# EAGLE schematic Charger (EAGLE 9.6.2)

## Sheet 1 of 2
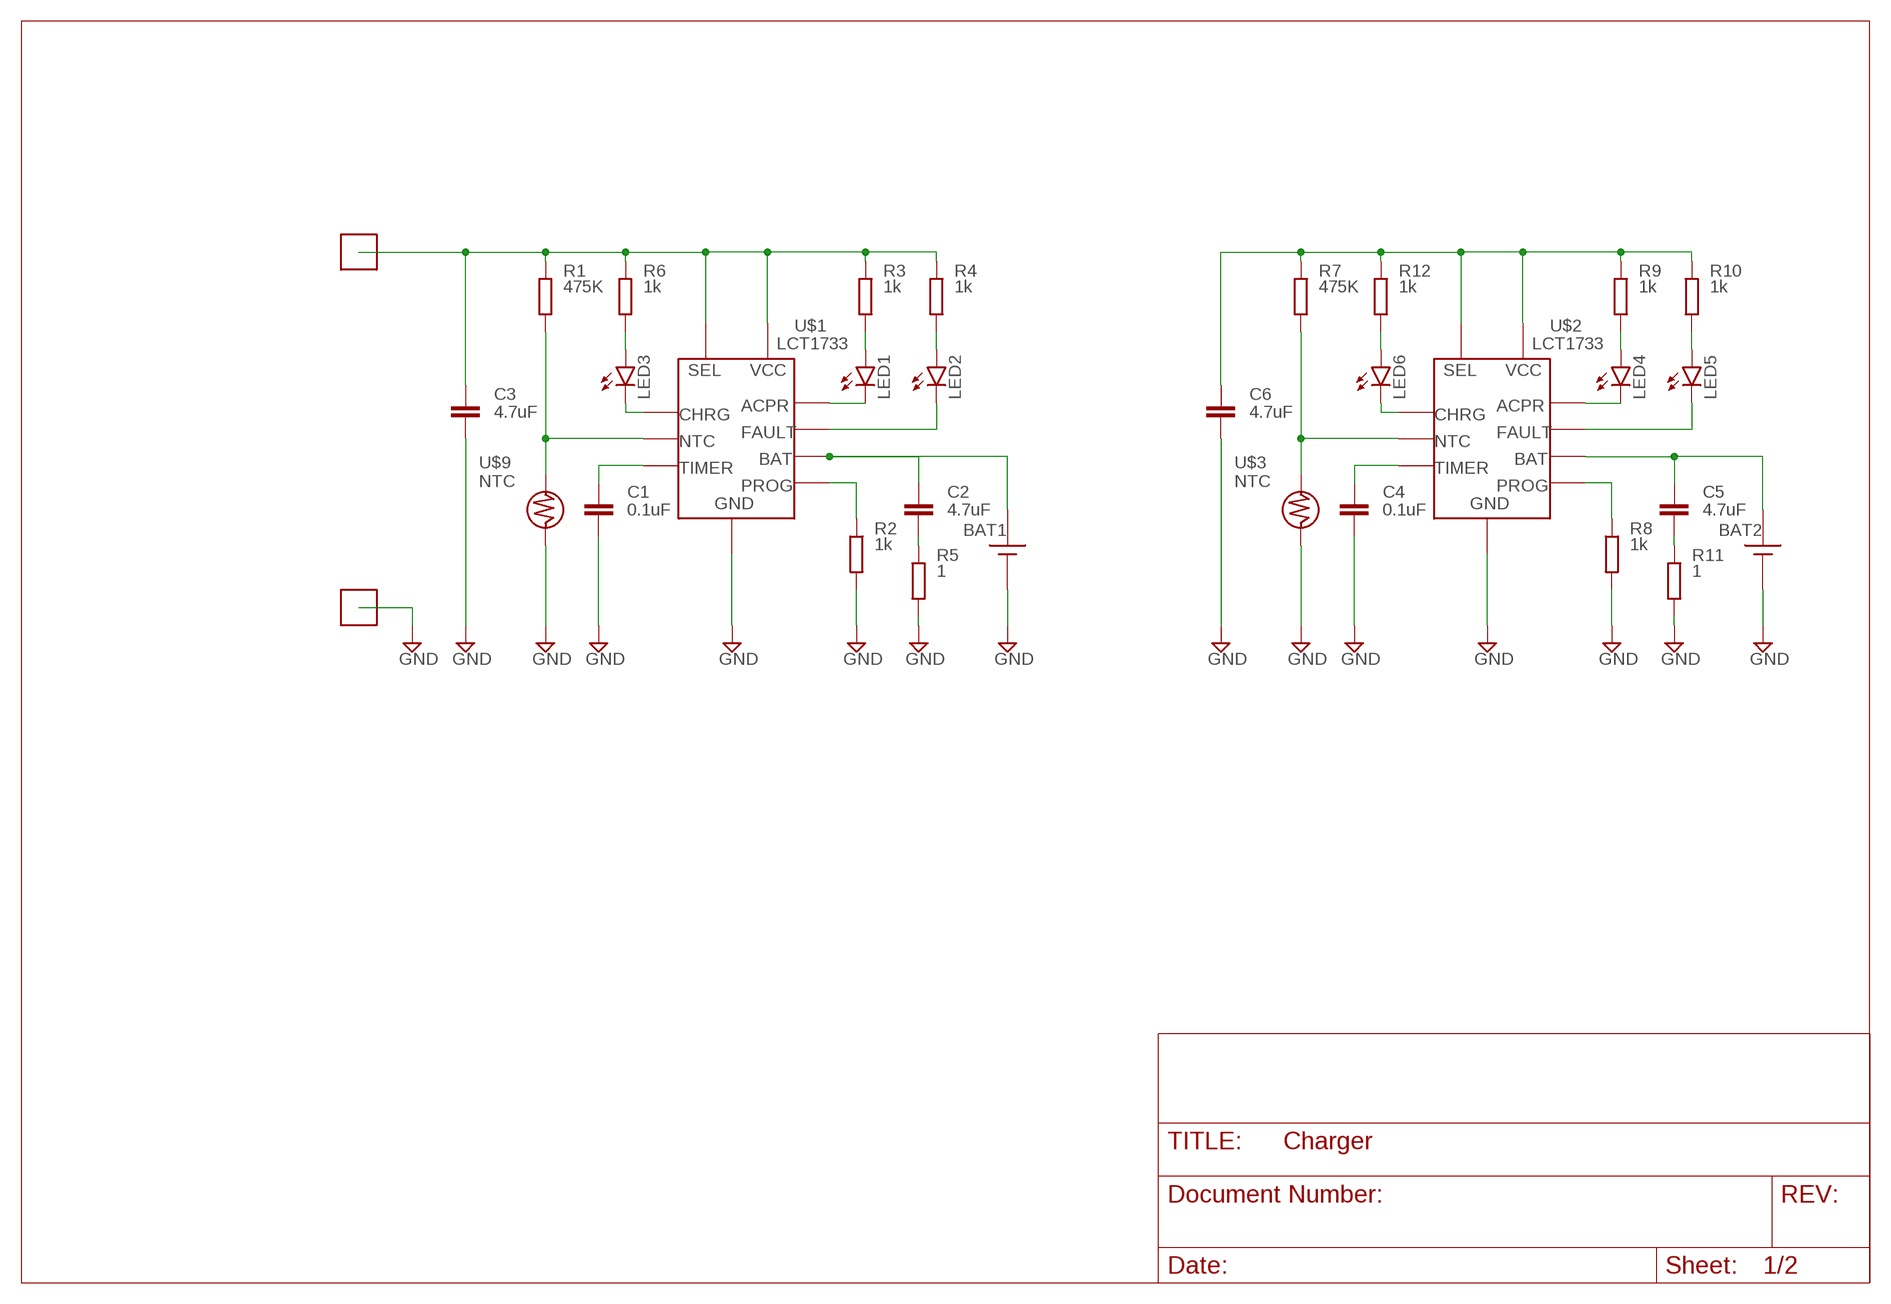
[diagram p0: schematic, sheet 1]

### Parts
BAT1  BATBAT  [BAT2]
BAT2  BAT  [BAT]
C1  0.1uF  C-EUC0603  [C0603]
C2  4.7uF  C-EUC0603  [C0603]
C3  4.7uF  C-EUC0603  [C0603]
C4  0.1uF  C-EUC0603  [C0603]
C5  4.7uF  C-EUC0603  [C0603]
C6  4.7uF  C-EUC0603  [C0603]
LED1  LEDSML0603  [SML0603]
LED2  LEDSML0603  [SML0603]
LED3  LEDSML0603  [SML0603]
LED4  LEDSML0603  [SML0603]
LED5  LEDSML0603  [SML0603]
LED6  LEDSML0603  [SML0603]
R1  475K  R-EU_R0603  [R0603]
R2  1k  R-EU_R0603  [R0603]
R3  1k  R-EU_R0603  [R0603]
R4  1k  R-EU_R0603  [R0603]
R5  1  R-EU_R0603  [R0603]
R6  1k  R-EU_R0603  [R0603]
R7  475K  R-EU_R0603  [R0603]
R8  1k  R-EU_R0603  [R0603]
R9  1k  R-EU_R0603  [R0603]
R10  1k  R-EU_R0603  [R0603]
R11  1  R-EU_R0603  [R0603]
R12  1k  R-EU_R0603  [R0603]
U$1  LCT1733  [MSOP-10_MSE]
U$2  LCT1733  [MSOP-10_MSE]
U$3  NTC  [C0603]
U$4  CONNECTOR  [VCC]
U$5  CONNECTOR  [VCC]
U$9  NTC  [C0603]

### Nets
GND: BAT1.P$2(-) BAT2.P$2(-) C1.2 C3.2 C4.2 C6.2 R2.2 R5.2 R8.2 R11.2 U$1.5(GND) U$1.11(GND) U$2.5(GND) U$2.11(GND) U$3.2 U$5.P$1 U$9.2
N$1: C3.1 R1.1 R3.1 R4.1 R6.1 U$1.2(VCC) U$1.8(SEL) U$4.P$1
N$2: R2.1 U$1.7(PROG)
N$3: LED1.C U$1.10(ACPR)
N$4: LED1.A R3.2
N$5: LED2.A R4.2
N$6: LED2.C U$1.3(FAULT)
N$7: BAT1.P$1(+) C2.1 U$1.9(BAT)
N$8: C2.2 R5.1
N$9: C1.1 U$1.4(TIM)
N$10: LED3.A R6.2
N$11: LED3.C U$1.1(CHRG)
N$12: R1.2 U$1.6(NTC) U$9.1
N$13: C6.1 R7.1 R9.1 R10.1 R12.1 U$2.2(VCC) U$2.8(SEL)
N$14: LED4.C U$2.10(ACPR)
N$15: LED4.A R9.2
N$16: LED5.A R10.2
N$17: LED5.C U$2.3(FAULT)
N$18: BAT2.P$1(+) C5.1 U$2.9(BAT)
N$19: R8.1 U$2.7(PROG)
N$20: C5.2 R11.1
N$21: C4.1 U$2.4(TIM)
N$22: LED6.A R12.2
N$23: LED6.C U$2.1(CHRG)
N$24: R7.2 U$2.6(NTC) U$3.1

## Sheet 2 of 2
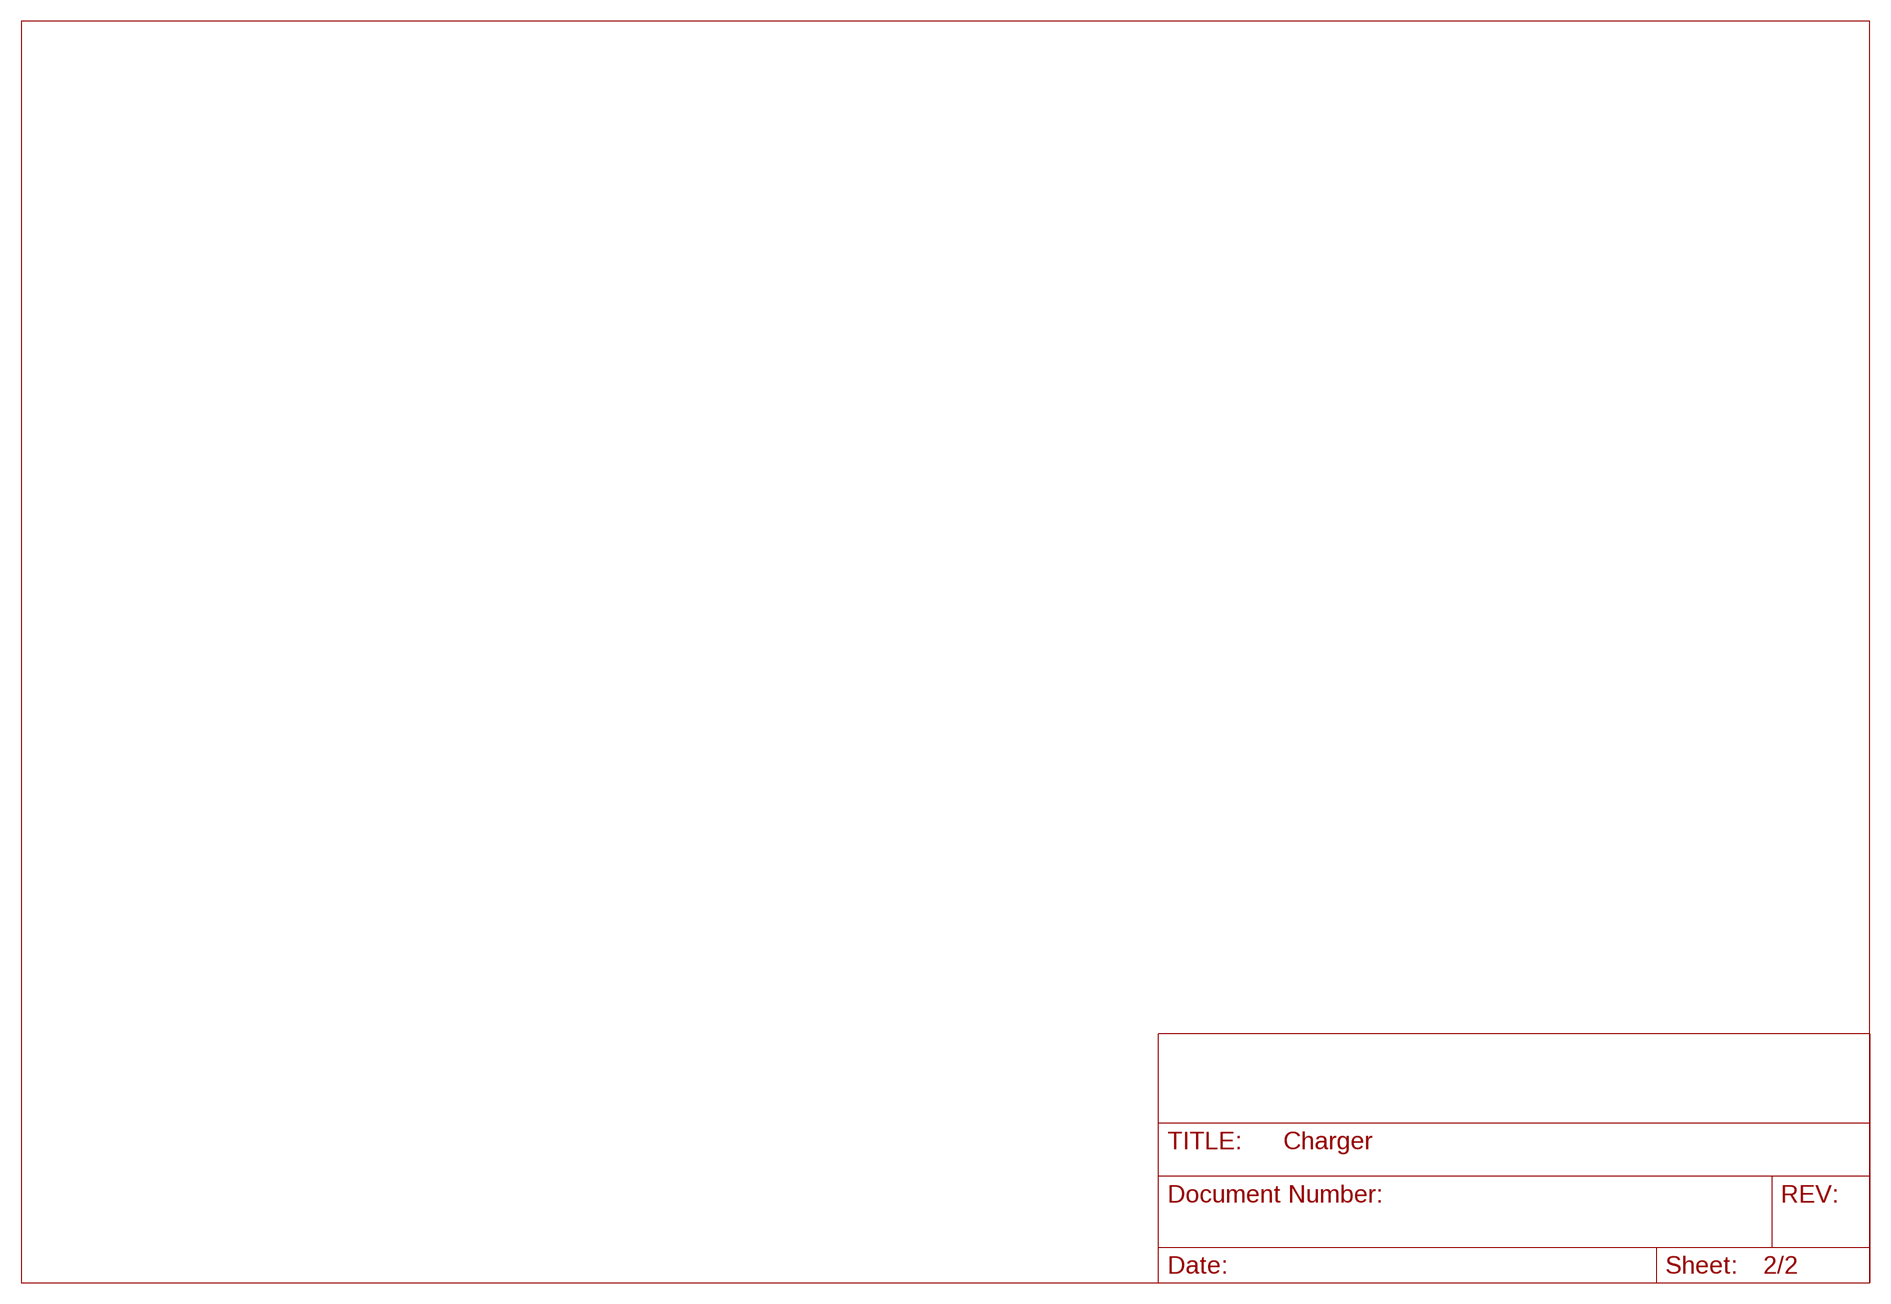
[diagram p1: schematic, sheet 2]

## Library data of the parts
BAT1 BAT2 = SamacSys_Parts:BAT
C1-C6 = rcl:C-EU: CAPACITOR, European symbol; SPICEPREFIX: C
LED1-LED6 = led:LED: LED OSRAM: - CHIPLED LG R971, LG N971, LY N971, LG Q971, LY Q971, LO R971, LY R971 LH N974, LH R974 LS Q976, LO Q976, LY Q976 LO Q996 - Hyper CHIPLED LW Q18S LB Q993, LB Q99A, LB R99A - SideLED LS A670, LO A670, LY A670, LG A670, LP A670 LB A673, LV A673, LT A673, LW A673 LH A674 LY A675 LS A676, LA A676, LO A676, LY A676, LW A676 LS A679, LY A679, LG A679 - Hyper Micro SIDELED® LS Y876, LA Y876, LO Y876, LY Y876 LT Y87S - SmartLED LW L88C, LW L88S LB L89C, LB L89S, LG L890 LS L89K, LO L89K, LY L89K LS L896, LA L896, LO L896, LY L896 - TOPLED LS T670, LO T670, LY T670, LG T670, LP T670 LSG T670, LSP T670, LSY T670, LOP T670, LYG T670 LG T671, LOG T671, LSG T671 LB T673, LV T673, LT T673, LW T673 LH T674 LS T676, LA T676, LO T676, LY T676, LB T676, LH T676, LSB T676, LW T676 LB T67C, LV T67C, LT T67C, LS T67K, LO T67K, LY T67K, LW E67C LS E67B, LA E67B, LO E67B, LY E67B, LB E67C, LV E67C, LT E67C LW T67C LS T679, LY T679, LG T679 LS T770, LO T770, LY T770, LG T770, LP T770 LB T773, LV T773, LT T773, LW T773 LH T774 LS E675, LA E675, LY E675, LS T675 LS T776, LA T776, LO T776, LY T776, LB T776 LHGB T686 LT T68C, LB T68C - Hyper Mini TOPLED® LB M676 - Mini TOPLED Santana® LG M470 LS M47K, LO M47K, LY M47K Source: http://www.osram.convergy.de LUXEON: - LUMILED® LXK2-PW12-R00, LXK2-PW12-S00, LXK2-PW14-U00, LXK2-PW14-V00 LXK2-PM12-R00, LXK2-PM12-S00, LXK2-PM14-U00 LXK2-PE12-Q00, LXK2-PE12-R00, LXK2-PE12-S00, LXK2-PE14-T00, LXK2-PE14-U00 LXK2-PB12-K00, LXK2-PB12-L00, LXK2-PB12-M00, LXK2-PB14-N00, LXK2-PB14-P00, LXK2-PB14-Q00 LXK2-PR12-L00, LXK2-PR12-M00, LXK2-PR14-Q00, LXK2-PR14-R00 LXK2-PD12-Q00, LXK2-PD12-R00, LXK2-PD12-S00 LXK2-PH12-R00, LXK2-PH12-S00 LXK2-PL12-P00, LXK2-PL12-Q00, LXK2-PL12-R00 Source: www.luxeon.com KINGBRIGHT: KA-3528ASYC Source: www.kingbright.com
R1-R12 = rcl:R-EU_: RESISTOR, European symbol; SPICEPREFIX: R
U$1 U$2 = SamacSys_Parts:LCT1733
U$3 U$9 = SamacSys_Parts:NTC
U$4 U$5 = SamacSys_Parts:CONNECTOR